# Altium schematic sheet SCH_Input.SchDoc
size A; SheetNumber: 1; SheetTotal: 1
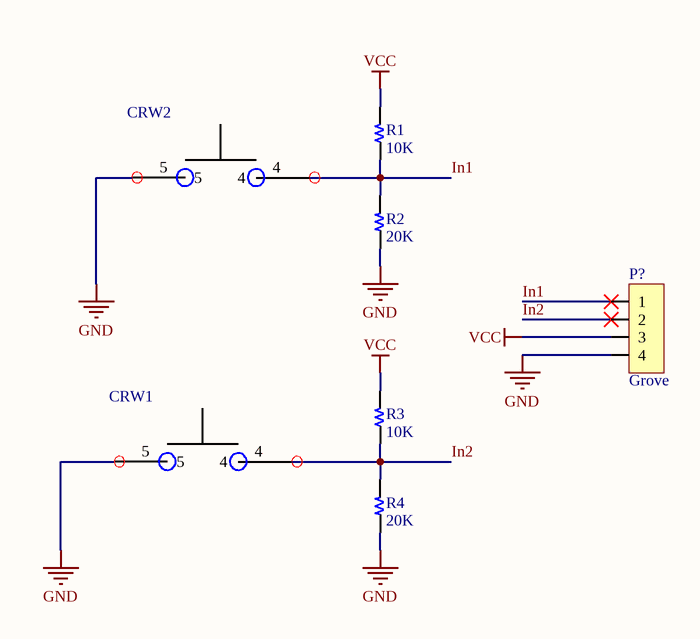
[diagram p0: SCH_Input.SchDoc]

## Parts
CRW1  (no value)  [SPGA48x11 - duplicate]
CRW2  (no value)  [SPGA48x11 - duplicate]
P?  Grove  [HDR/Header/4/2mm/BOX/SMD]
R1  10K  [R 0805]
R2  20K  [R 0805]
R3  10K  [R 0805]
R4  20K  [R 0805]

## Nets
GND: CRW1.5 CRW2.5 P?.4 R2.1 R4.1
VCC: P?.3 R1.2 R3.2
In1: CRW2.4 P?.1 R1.1 R2.2
In2: CRW1.4 P?.2 R3.1 R4.2

## Library data of the parts
CRW1 CRW2 = CR
P? = Header 4: Header, 4-Pin
R1-R4 = Resistor